# Altium project Mecha Numpad.PrjPcb
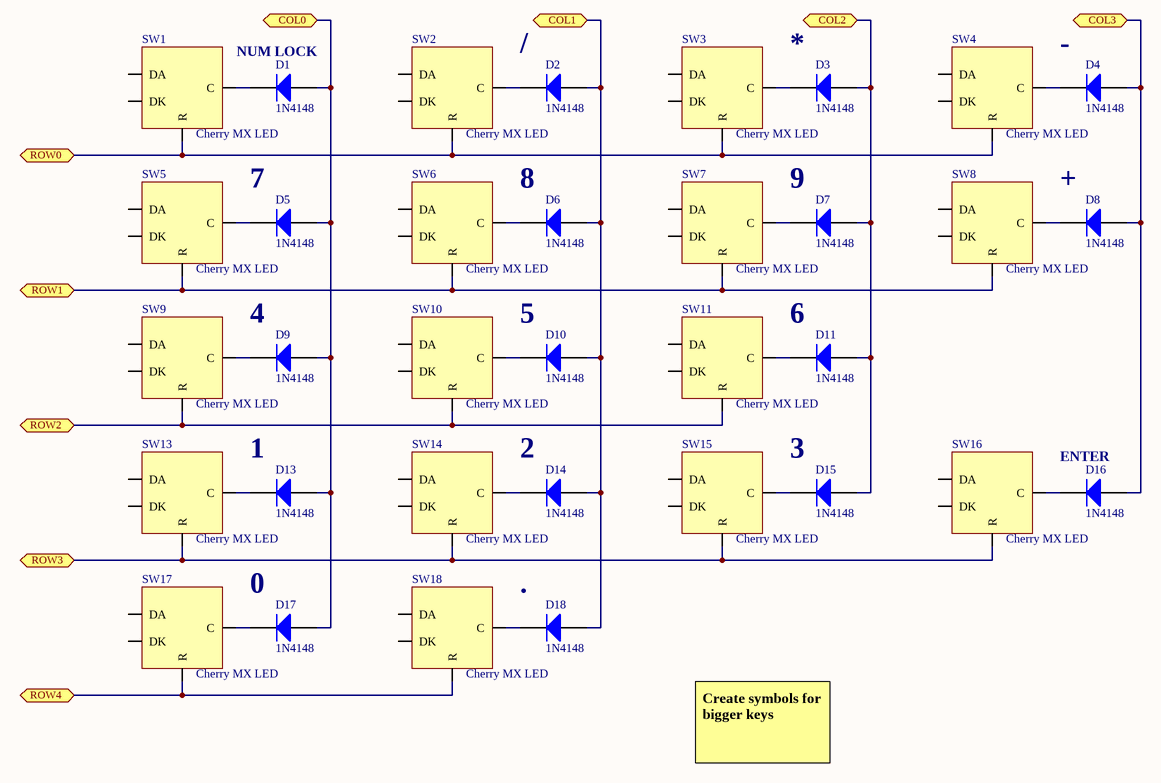
[diagram p0: Keys.SchDoc]
2 sheets, 52 parts. Net scope: flat (ports and power ports of the same name join across sheets).
Board file: MainBoard.PcbDoc
Sheets:
  Keys.SchDoc
  MCU.SchDoc

## Sheet Keys.SchDoc
size A4

### Parts
D1  1N4148  [NXP-SOD27-2_V]
D2  1N4148  [NXP-SOD27-2_V]
D3  1N4148  [NXP-SOD27-2_V]
D4  1N4148  [NXP-SOD27-2_V]
D5  1N4148  [NXP-SOD27-2_V]
D6  1N4148  [NXP-SOD27-2_V]
D7  1N4148  [NXP-SOD27-2_V]
D8  1N4148  [NXP-SOD27-2_V]
D9  1N4148  [NXP-SOD27-2_V]
D10  1N4148  [NXP-SOD27-2_V]
D11  1N4148  [NXP-SOD27-2_V]
D13  1N4148  [NXP-SOD27-2_V]
D14  1N4148  [NXP-SOD27-2_V]
D15  1N4148  [NXP-SOD27-2_V]
D16  1N4148  [NXP-SOD27-2_V]
D17  1N4148  [NXP-SOD27-2_V]
D18  1N4148  [NXP-SOD27-2_V]
SW1  Cherry MX LED  [Cherry MX LED]
SW2  Cherry MX LED  [Cherry MX LED]
SW3  Cherry MX LED  [Cherry MX LED]
SW4  Cherry MX LED  [Cherry MX LED]
SW5  Cherry MX LED  [Cherry MX LED]
SW6  Cherry MX LED  [Cherry MX LED]
SW7  Cherry MX LED  [Cherry MX LED]
SW8  Cherry MX LED  [Cherry MX LED]
SW9  Cherry MX LED  [Cherry MX LED]
SW10  Cherry MX LED  [Cherry MX LED]
SW11  Cherry MX LED  [Cherry MX LED]
SW13  Cherry MX LED  [Cherry MX LED]
SW14  Cherry MX LED  [Cherry MX LED]
SW15  Cherry MX LED  [Cherry MX LED]
SW16  Cherry MX LED  [Cherry MX LED]
SW17  Cherry MX LED  [Cherry MX LED]
SW18  Cherry MX LED  [Cherry MX LED]

### Ports
COL0 (bidir), COL1 (bidir), COL2 (bidir), COL3 (bidir), ROW0 (bidir), ROW1 (bidir), ROW2 (bidir), ROW3 (bidir), ROW4 (bidir)

### Nets
COL0: D1.1(A) D5.1(A) D9.1(A) D13.1(A) D17.1(A) ; port COL0
COL1: D2.1(A) D6.1(A) D10.1(A) D14.1(A) D18.1(A) ; port COL1
COL2: D3.1(A) D7.1(A) D11.1(A) D15.1(A) ; port COL2
COL3: D4.1(A) D8.1(A) D16.1(A) ; port COL3
ROW0: SW1.1(R) SW2.1(R) SW3.1(R) SW4.1(R) ; port ROW0
ROW1: SW5.1(R) SW6.1(R) SW7.1(R) SW8.1(R) ; port ROW1
ROW2: SW9.1(R) SW10.1(R) SW11.1(R) ; port ROW2
ROW3: SW13.1(R) SW14.1(R) SW15.1(R) SW16.1(R) ; port ROW3
ROW4: SW17.1(R) SW18.1(R) ; port ROW4
NetD1_2: D1.2(K) SW1.2(C)
NetD2_2: D2.2(K) SW2.2(C)
NetD3_2: D3.2(K) SW3.2(C)
NetD4_2: D4.2(K) SW4.2(C)
NetD5_2: D5.2(K) SW5.2(C)
NetD6_2: D6.2(K) SW6.2(C)
NetD7_2: D7.2(K) SW7.2(C)
NetD8_2: D8.2(K) SW8.2(C)
NetD9_2: D9.2(K) SW9.2(C)
NetD10_2: D10.2(K) SW10.2(C)
NetD11_2: D11.2(K) SW11.2(C)
NetD13_2: D13.2(K) SW13.2(C)
NetD14_2: D14.2(K) SW14.2(C)
NetD15_2: D15.2(K) SW15.2(C)
NetD16_2: D16.2(K) SW16.2(C)
NetD17_2: D17.2(K) SW17.2(C)
NetD18_2: D18.2(K) SW18.2(C)

Not connected (* = marked no-connect by the designer): SW1 3(DA) 4(DK); SW2 3(DA) 4(DK); SW3 3(DA) 4(DK); SW4 3(DA) 4(DK); SW5 3(DA) 4(DK); SW6 3(DA) 4(DK); SW7 3(DA) 4(DK); SW8 3(DA) 4(DK); SW9 3(DA) 4(DK); SW10 3(DA) 4(DK); SW11 3(DA) 4(DK); SW13 3(DA) 4(DK); SW14 3(DA) 4(DK); SW15 3(DA) 4(DK); SW16 3(DA) 4(DK); SW17 3(DA) 4(DK); SW18 3(DA) 4(DK)

### Notes on the sheet
- NUM LOCK
- /
- *
- -
- 7
- 8
- 9
- +
- 4
- 5
- 6
- 1
- 2
- 3
- ENTER
- 0
- .
- Create symbols for bigger keys

### Library data of the parts
D1-D11 D13-D18 = CMP-0648-00002-1: High-speed Diode, 100 V, 450 mA, 2-Pin SOD27, RoHS; Manufacturer: NXP Semiconductors; Configuration: Single; IR (VR: 20 V)=25 nA; IFRM: 450 mA; IFSM: 4 A Max.; Trr: 4 ns Max.; Cd: 4 pF Max.; VR: 100 V Max.; VF (IF: 10 mA)=1 V; IF: 200 mA Max.; ComponentLink1Description: Manufacturer URL; RoHS: TRUE; ComponentLink1URL: http://www.nxp.com/; ComponentLink3Description: Package Specification; DatasheetVersion: Aug-04; ComponentLink2Description: Datasheet; PackageVersion: Aug-04; PackageReference: SOD27; ComponentLink3URL: http://www.nxp.com/documents/data_sheet/1N4148_1N4448.pdf; Mounting Technology: Through Hole; ComponentLink2URL: http://www.nxp.com/documents/data_sheet/1N4148_1N4448.pdf; PartNumber: 1N4148; PackageDescription: 2-Pin Hermetically Sealed Glass Package, Axial Leaded, Dia 1.85 mm, Body Length 4.25 mm, Lead Spread 25.4 mm

## Sheet MCU.SchDoc
size A4
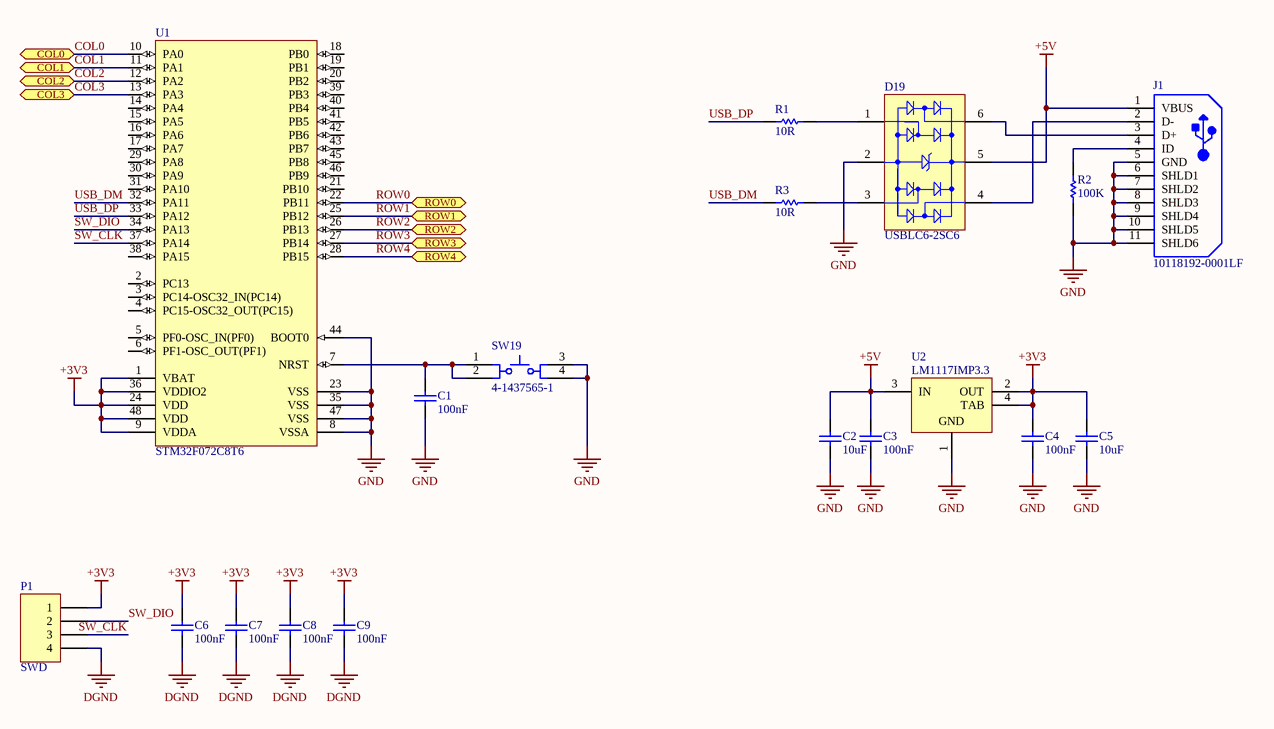
[diagram p1: MCU.SchDoc]

### Parts
C1  100nF  [CAPC0603(1608)100_M]
C2  10uF  [CAPC1206(3216)190_L]
C3  100nF  [CAPC0603(1608)100_M]
C4  100nF  [CAPC0603(1608)100_M]
C5  10uF  [CAPC1206(3216)190_L]
C6  100nF  [CAPC0603(1608)100_M]
C7  100nF  [CAPC0603(1608)100_M]
C8  100nF  [CAPC0603(1608)100_M]
C9  100nF  [CAPC0603(1608)100_M]
D19  USBLC6-2SC6  [STM-SOT23-6L_V]
J1  10118192-0001LF  [FCI-10118192-0001LF-5_V]
P1  SWD  [HDR1X4H]
R1  10R  [RESC0603(1608)_L]
R2  100K  [RESC0603(1608)_N]
R3  10R  [RESC0603(1608)_L]
SW19  4-1437565-1  [TECO-4-1437565-1_V]
U1  STM32F072C8T6  [STM-LQFP48_M]
U2  LM1117IMP3.3  [DCY0004A_N]

### Ports
COL0 (bidir), COL1 (bidir), COL2 (bidir), COL3 (bidir), ROW0 (bidir), ROW1 (bidir), ROW2 (bidir), ROW3 (bidir), ROW4 (bidir)

### Nets
+3V3: C4.2 C5.2 C6.2 C7.2 C8.2 C9.2 P1.1 U1.1(VBAT) U1.9(VDDA) U1.24(VDD) U1.36(VDDIO2) U1.48(VDD) U2.2(OUT) U2.4(TAB)
+5V: C2.2 C3.2 D19.5(VBUS) J1.1(VBUS) U2.3(IN)
DGND: C6.1 C7.1 C8.1 C9.1 P1.4
GND: C1.1 C2.1 C3.1 C4.1 C5.1 D19.2(GND) J1.5(GND) J1.6(SHLD1) J1.7(SHLD2) J1.8(SHLD3) J1.9(SHLD4) J1.10(SHLD5) J1.11(SHLD6) R2.1 SW19.3 SW19.4 U1.8(VSSA) U1.23(VSS) U1.35(VSS) U1.44(BOOT0) U1.47(VSS) U2.1(GND)
COL0: U1.10(PA0) ; port COL0
COL1: U1.11(PA1) ; port COL1
COL2: U1.12(PA2) ; port COL2
COL3: U1.13(PA3) ; port COL3
ROW0: U1.22(PB11) ; port ROW0
ROW1: U1.25(PB12) ; port ROW1
ROW2: U1.26(PB13) ; port ROW2
ROW3: U1.27(PB14) ; port ROW3
ROW4: U1.28(PB15) ; port ROW4
SW_CLK: P1.3 U1.37(PA14)
SW_DIO: P1.2 U1.34(PA13)
USB_DM: R3.1 U1.32(PA11)
USB_DP: R1.1 U1.33(PA12)
NetC1_2: C1.2 SW19.1 SW19.2 U1.7(NRST)
NetD19_1: D19.1(I/O_1) R1.2
NetD19_3: D19.3(I/O_2) R3.2
NetD19_4: D19.4(I/O_3) J1.2(D-)
NetD19_6: D19.6(I/O_4) J1.3(D+)
NetJ1_4: J1.4(ID) R2.2

Not connected (* = marked no-connect by the designer): U1 2(PC13) 3(PC14-OSC32_IN(PC14)) 4(PC15-OSC32_OUT(PC15)) 5(PF0-OSC_IN(PF0)) 6(PF1-OSC_OUT(PF1)) 14(PA4) 15(PA5) 16(PA6) 17(PA7) 18(PB0) 19(PB1) 20(PB2) 21(PB10) 29(PA8) 30(PA9) 31(PA10) 38(PA15) 39(PB3) 40(PB4) 41(PB5) 42(PB6) 43(PB7) 45(PB8) 46(PB9)

### Library data of the parts
C1 C3 C4 C6-C9 = CMP-1035-02590-1: CAP 100nF 25V -20% to +80% 0603 (1608 Metric) Thickness 1mm SMD; Case-EIA: 0603; Case-Metric: 1608; Rated Voltage: 25 V; Technology: SMT; Value: 100nF; Tolerance: -20% to +80%; Max Thickness: 1 mm
C2 C5 = CMP-1037-04974-1: CAP 10uF 16V ±10% 1206 (3216 Metric) Thickness 1.9mm SMD; Case-EIA: 1206; Case-Metric: 3216; Tolerance: Â±10%; Rated Voltage: 16 V; Max Thickness: 1.9 mm; Value: 10uF; Technology: SMT
D19 = CMP-2000-05378-1: Very low capacitance ESD protection, 3.5 pF, -40 to 125 degC, 6-Pin SOT23, RoHS, Tape and Reel; Manufacturer: STMicroelectronics; Polarity: Uni-Directional; Clamping Voltage: 17V; Rad Hardened: No; Product Height (mm): 1.3mm; Leakage Current (Max): 0.15uA; Product Length (mm): 3.05mm; Number of Elements: 1; Peak Pulse Current: 5A; Configuration: Dual; Reverse Breakdown Voltage: 6V; Working Voltage (Max): 5V; Capacitance Value: 3.5pF; Suppressor Type: DiodeArrays; Product Depth (mm): 1.75mm; Test Current (It): 1mA; Package / Case: SOT-23; Operating Temperature Max Deg. C: 125C; Package Description: 6-Pin Small Outline Transistor, Body 2.925 x 1.625 mm, Pitch 0.95 mm; Package Reference: SOT23-6L; Datasheet Version: Rev. 5, 10/2011; Operating Temperature Min Deg. C: -40C; Mounting Style: SurfaceMount; Direction Type: Uni-Directional; Mounting: SurfaceMount; Pin Count: 6; Leakage Current: 0.15uA; Packaging: TapeandReel; Operating Temperature Classification: Automotive; Clamping Voltage (Max): 17V; Manufacturer URL: http://www.st.com/; Reverse Stand-off Voltage: 5V; Datasheet URL: http://www.st.com/st-web-ui/static/active/en/resource/technical/document/datasheet/CD00050750.pdf; Working Voltage: 5V; Operating Temp Range: -40Cto125C
J1 = CMP-2000-05118-1: Micro USB B Type Receptacle, -55 to 85 degC, 5-Pin SMD, RoHS, Tape and Reel; Manufacturer: FCI; Current Rating: 1.8A; Number of Contacts: 5Contact; Mounting Angle: Right; Insulation Resistance: 1000MOhms; Connector Type: MicroUSBTypeBreceptacle; Gender: Female; Packaging: Reel; Termination Style: SMD/SMT; Product Category: USBConnectors; RoHS: Details; Flammability Rating: UL94V-0; Standard: USB2.0; Brand: FCI; Manufacturer URL: http://www.fci.com/; Product: MicroUSBTypeBConnectors; Operating Temperature Range: -55Cto+85C; Datasheet Version: Rev. B, 05/2015; Contact Material: CopperAlloy; Contact Plating: Gold; Datasheet URL: http://www.mouser.com/ds/2/154/10118192-793027.pdf; Color: Black; Factory Pack Quantity: 1400
P1 = Header 4H: Header, 4-Pin, Right Angle; LatestRevisionDate: 17-Jul-2002; LatestRevisionNote: Re-released for DXP Platform.; Publisher: Altium Limited
R1 R3 = CMP-1012-00284-1: 10R 0.1W 1% 0603 (1608 Metric)  SMD; Case-Metric: 1608; Case-EIA: 0603; Value: 10.00 Ohm; Tolerance: 1 %; Power: 0.1 W; Technology: SMT
R2 = CMP-1012-00736-1: 100K 0.1W 1% 0603 (1608 Metric)  SMD; Value: 100000.00 Ohm; Case-Metric: 1608; Case-EIA: 0603; Power: 0.1 W; Tolerance: 1 %; Technology: SMT
SW19 = CMP-2000-05602-1: Tactile Switch, 50 mA, 12 VDC, -20 to 85 degC, 4-Pin SMD, RoHS, Bulk; Manufacturer: TEConnectivity/AMPBrand; Illumination Type: N/R; Maximum Contact Resistance: 100mOhm; Actuator Style: RoundButton; Actuator Length: 1.4mm; Contact Rating @ Voltage: 0.05@12VDCA; Maximum DC Voltage Rating: 12V; Body Orientation: Straight; Ground Terminal: No; Dielectric Strength: 500VAC; Operating Force: 1.57N; Electrical Life: 100000Cycle; Mechanical Life: N/A; Family: FSMJSMA; Contact Material: CopperAlloy; Type: N/A; RoHS: Yes; Pole Throw Configuration: N/A; Operating Temperature: -20to85C; Minimum Insulation Resistance: 100MOhm; Package Description: 4-Pin Surface Mount Device, Body 6 x 6 mm, Pitch 9.1 mm; Housing Material: N/A; Switch Configuration: N/A; Mounting: SurfaceMount,GullWing; Datasheet URL: https://datasheet.ciiva.com/14635/0900766b80912216-14635826.pdf; Packaging: Bulk; Base Material: N/A; Actuator Color: N/A; Dimension: 6x10x5.25mm; Contact Plating: Silver; Seal Location: N/A; Mounting Technology: SurfaceMount; Part No: 4-1437565-1; Seal Description: N/A; Maximum AC Voltage Rating: N/A; Datasheet Version: 04/2007; Manufacturer URL: http://www.te.com/; Package Reference: 4-1437565-1; Product Weight: N/A
U1 = CMP-0304-00165-2: ARM Cortex-M0 32-bit MCU, 64 KB Flash, 16 KB Internal RAM, 37 I/Os, 48-Pin LQFP, -40 to 85 degC, Tray; Manufacturer: STMicroelectronics; Operating Frequency(F) (Processor speed) (MHz): 48; FLASH Size (Prog) (kB): 64; I/Os (High Current): 37; D/A Converter: 1; Internal RAM Size (kB): 16; Supply Voltage(Vcc) min (V): 2; Package Reference: LQFP48; DatasheetVersion: Rev. 5; Core: ARM Cortex-M0; ComponentLink1Description: Manufacturer URL; ComponentLink1URL: http://www.st.com/; Packing: Tray; Mounting Technology: Surface Mount; Package Description: 48-Pin Low Profile Quad Flat Package, Body 7 x 7 mm, Pitch 0.5 mm; ComponentLink2URL: http://www.st.com/st-web-ui/static/active/en/resource/technical/document/datasheet/DM00090510.pdf; ComponentLink2Description: Datasheet; PartNumber: STM32F072C8T6
U2 = CMP-0062-01631-4: 800mA Low-Dropout Linear Regulator, 4-pin SOT-223, Pb-Free; PartNumber: LM1117IMP-3.3/NOPB; Manufacturer: Texas Instruments; PackageTopMarking: XYTT*N05B; PowerWise: N; High-Reliability: Y; CompType: LDO IC; Code_IPC: SOT223-4; PackageReference: DCY0004A; PinCount: 4; PackageDescription: Molded SOT-223, 6.50 x 3.56 x 1.6mm Body, 4 Lead, 2.3mm Pitch; RoHS: Y; ComponentLink1Description: Datasheet URL; Code_JEDEC: TO-261-AA; ComponentLink1URL: http://www.ti.com/general/docs/lit/getliterature.tsp?genericPartNumber=LM1117-N&fileType=pdf

## Nets that join several sheets
COL0: Keys (5 pins), MCU (U1.10)
COL1: Keys (5 pins), MCU (U1.11)
COL2: Keys (D3.1 D7.1 D11.1 D15.1), MCU (U1.12)
COL3: Keys (D4.1 D8.1 D16.1), MCU (U1.13)
ROW0: Keys (SW1.1 SW2.1 SW3.1 SW4.1), MCU (U1.22)
ROW1: Keys (SW5.1 SW6.1 SW7.1 SW8.1), MCU (U1.25)
ROW2: Keys (SW9.1 SW10.1 SW11.1), MCU (U1.26)
ROW3: Keys (SW13.1 SW14.1 SW15.1 SW16.1), MCU (U1.27)
ROW4: Keys (SW17.1 SW18.1), MCU (U1.28)